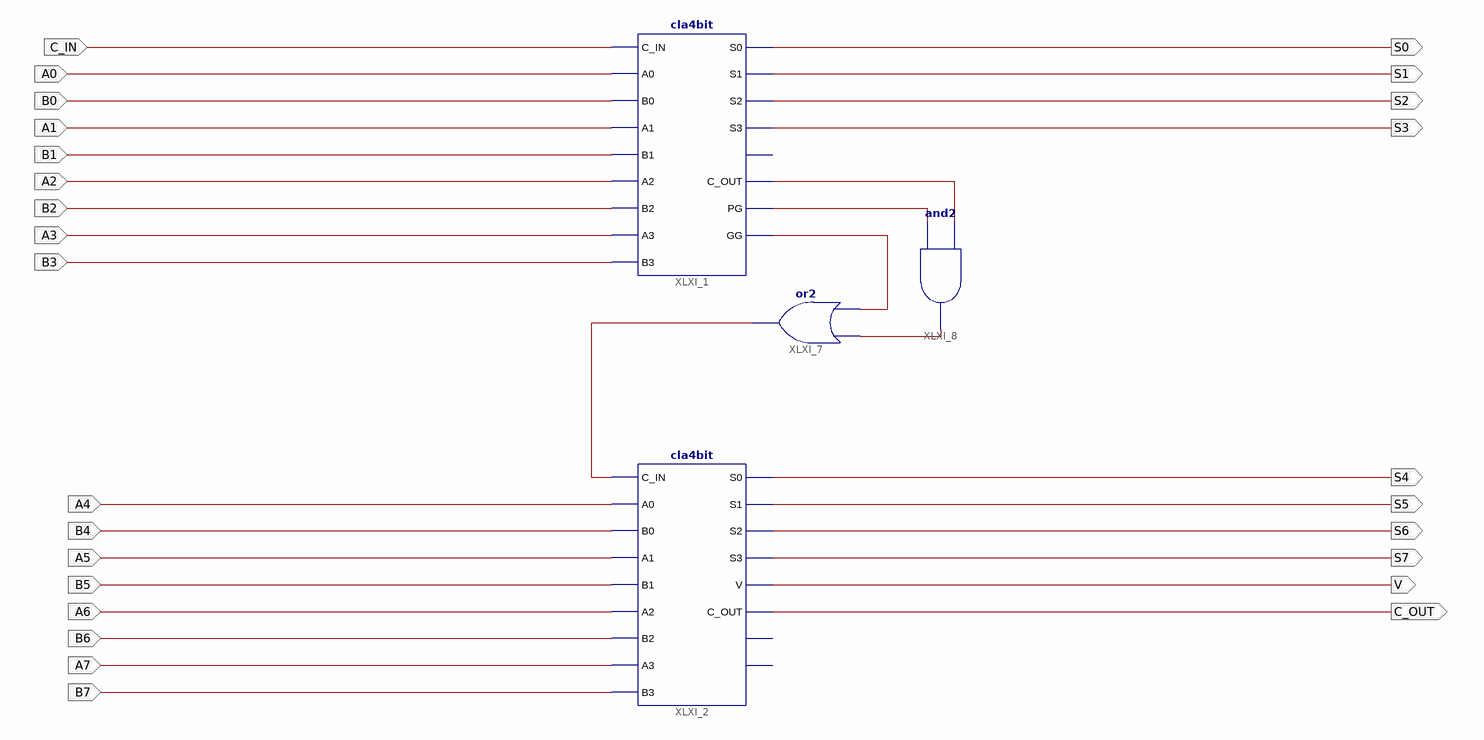
[diagram p0: schematic sheet 1]
// Xilinx ISE schematic lcu8bit.sch (spartan3e) as structural Verilog: 4 symbols, 27 ports
module lcu8bit (
  input  C_IN,
  input  A0,
  input  B0,
  input  A1,
  input  B1,
  input  A2,
  input  B2,
  input  A3,
  input  B3,
  input  A4,
  input  B4,
  input  A5,
  input  B5,
  input  A6,
  input  B6,
  input  A7,
  input  B7,
  output S4,
  output S5,
  output S6,
  output S7,
  output V,
  output C_OUT,
  output S0,
  output S1,
  output S2,
  output S3
);

  wire XLXN_111, XLXN_114, XLXN_115, XLXN_120, XLXN_121;

  cla4bit XLXI_1 (
    .C_IN(C_IN), .A1(A1), .B1(B1), .A2(A2), .B2(B2), .A3(A3), .B3(B3), .A0(A0), .B0(B0), .S0(S0), .S1(S1),
    .S2(S2), .S3(S3), .C_OUT(XLXN_114), .PG(XLXN_115), .GG(XLXN_111));  // open: V
  cla4bit XLXI_2 (
    .C_IN(XLXN_121), .A1(A5), .B1(B5), .A2(A6), .B2(B6), .A3(A7), .B3(B7), .A0(A4), .B0(B4), .S0(S4),
    .S1(S5), .S2(S6), .S3(S7), .V(V), .C_OUT(C_OUT));  // open: PG, GG
  or XLXI_7 (XLXN_121, XLXN_111, XLXN_120);
  and XLXI_8 (XLXN_120, XLXN_115, XLXN_114);
endmodule
